# Altium schematic sheet visual_tactile.SchDoc
size A4; SheetNumber: 1; SheetTotal: 6
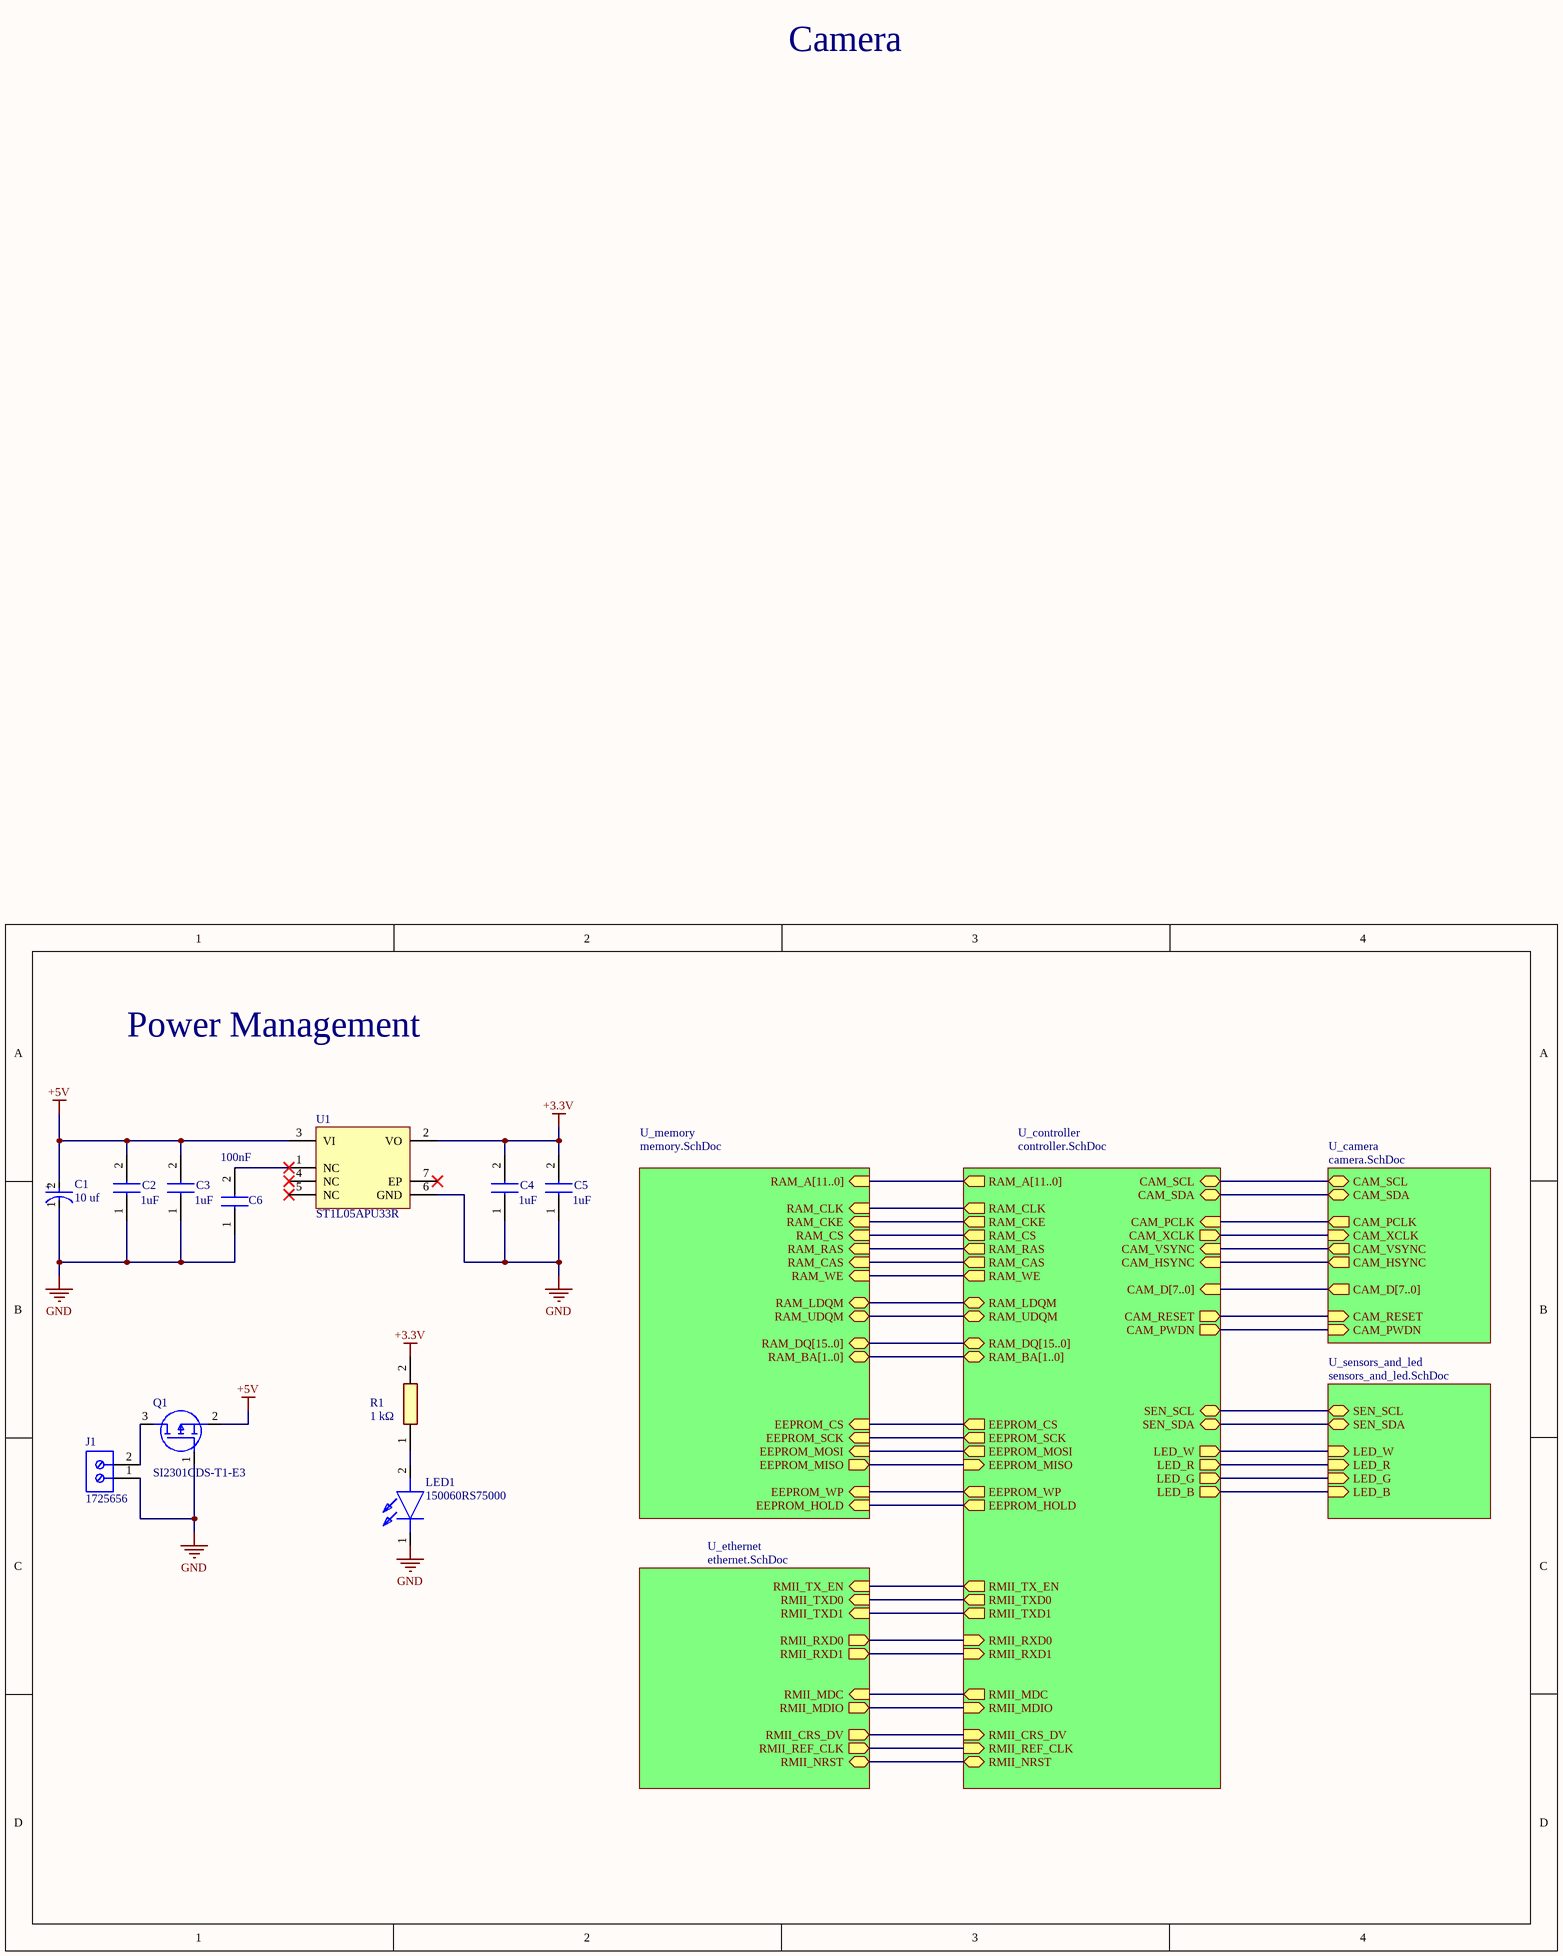
[diagram p0: visual_tactile.SchDoc]

## Parts
C1  10 uf  [FP-T491D-MFG]
C2  value 1uF  [CAPC1608X87N]
C3  value 1uF  [CAPC1608X87N]
C4  value 1uF  [CAPC1608X87N]
C5  value 1uF  [CAPC1608X87N]
C6  value 100nF  [CAPC1608X87N]  (hidden comment: CGA3E2X7R1H104K080AA)
J1  1725656  [PHOE-1725656-2]
LED1  150060RS75000  [LEDC1608X80N]
Q1  SI2301CDS-T1-E3  [SOT95P237X112-3N]
R1  1 kΩ  [RESC1005X35N]
U1  ST1L05APU33R  [DFN6D_M]

## Sub-sheets
U_camera = camera.SchDoc: CAM_SCL (bidir), CAM_SDA (bidir), CAM_RESET (in), CAM_PCLK (out), CAM_HSYNC (out), CAM_VSYNC (out), CAM_D[7..0] (out), CAM_XCLK (in), CAM_PWDN (in)
U_controller = controller.SchDoc: CAM_D[7..0] (in), CAM_PCLK (in), CAM_VSYNC (in), CAM_XCLK (out), CAM_HSYNC (in), CAM_SCL (bidir), CAM_SDA (bidir), CAM_RESET (out), CAM_PWDN (out), SEN_SCL (bidir), SEN_SDA (bidir), EEPROM_CS (out), EEPROM_SCK (out), EEPROM_MOSI (out), EEPROM_WP (out), EEPROM_HOLD (out), EEPROM_MISO (in), RAM_A[11..0] (out), RAM_DQ[15..0] (bidir), RAM_BA[1..0] (bidir), RAM_CLK (out), RAM_CKE (out), RAM_CS (out), RAM_RAS (out), RAM_CAS (out), RAM_WE (out), RAM_LDQM (bidir), RAM_UDQM (bidir), RMII_TX_EN (out), RMII_TXD0 (out), RMII_TXD1 (out), RMII_RXD0 (in), RMII_RXD1 (in), RMII_CRS_DV (in), RMII_MDC (out), RMII_MDIO (in), RMII_NRST (bidir), RMII_REF_CLK (in), LED_W (out), LED_R (out), LED_G (out), LED_B (out)
U_ethernet = ethernet.SchDoc: RMII_TX_EN (in), RMII_TXD0 (in), RMII_TXD1 (in), RMII_RXD0 (out), RMII_RXD1 (out), RMII_CRS_DV (out), RMII_MDC (in), RMII_MDIO (out), RMII_NRST (bidir), RMII_REF_CLK (out)
U_memory = memory.SchDoc: EEPROM_CS (in), EEPROM_SCK (in), EEPROM_MOSI (in), EEPROM_WP (in), EEPROM_HOLD (in), EEPROM_MISO (out), RAM_A[11..0] (in), RAM_DQ[15..0] (bidir), RAM_BA[1..0] (bidir), RAM_CLK (in), RAM_CKE (in), RAM_CS (in), RAM_RAS (in), RAM_CAS (in), RAM_WE (in), RAM_LDQM (bidir), RAM_UDQM (bidir)
U_sensors_and_led = sensors_and_led.SchDoc: SEN_SCL (bidir), SEN_SDA (bidir), LED_W (in), LED_R (in), LED_G (in), LED_B (in)

## Nets
+3.3V: C4.2 C5.2 R1.2 U1.2(VO)
+5V: C1.2(A) C2.2 C3.2 Q1.2(S) U1.3(VI)
GND: C1.1(C) C2.1 C3.1 C4.1 C5.1 C6.1 J1.1 LED1.1(K) Q1.1(G) U1.6(GND)
NetC6_2: C6.2 U1.1(NC)
NetJ1_2: J1.2 Q1.3(D)
NetLED1_2: LED1.2(A) R1.1
(unnamed): sheet U_controller/CAM_PCLK, sheet U_camera/CAM_PCLK
(unnamed): sheet U_controller/CAM_VSYNC, sheet U_camera/CAM_VSYNC
(unnamed): sheet U_controller/CAM_XCLK, sheet U_camera/CAM_XCLK
(unnamed): sheet U_controller/CAM_HSYNC, sheet U_camera/CAM_HSYNC
(unnamed): sheet U_controller/CAM_SCL, sheet U_camera/CAM_SCL
(unnamed): sheet U_controller/CAM_SDA, sheet U_camera/CAM_SDA
(unnamed): sheet U_controller/CAM_RESET, sheet U_camera/CAM_RESET
(unnamed): sheet U_controller/CAM_PWDN, sheet U_camera/CAM_PWDN
(unnamed): sheet U_controller/SEN_SCL, sheet U_sensors_and_led/SEN_SCL
(unnamed): sheet U_controller/SEN_SDA, sheet U_sensors_and_led/SEN_SDA
(unnamed): sheet U_controller/EEPROM_CS, sheet U_memory/EEPROM_CS
(unnamed): sheet U_controller/EEPROM_SCK, sheet U_memory/EEPROM_SCK
(unnamed): sheet U_controller/EEPROM_MOSI, sheet U_memory/EEPROM_MOSI
(unnamed): sheet U_controller/EEPROM_WP, sheet U_memory/EEPROM_WP
(unnamed): sheet U_controller/EEPROM_HOLD, sheet U_memory/EEPROM_HOLD
(unnamed): sheet U_controller/EEPROM_MISO, sheet U_memory/EEPROM_MISO
(unnamed): sheet U_controller/RAM_CLK, sheet U_memory/RAM_CLK
(unnamed): sheet U_controller/RAM_CKE, sheet U_memory/RAM_CKE
(unnamed): sheet U_controller/RAM_CS, sheet U_memory/RAM_CS
(unnamed): sheet U_controller/RAM_RAS, sheet U_memory/RAM_RAS
(unnamed): sheet U_controller/RAM_CAS, sheet U_memory/RAM_CAS
(unnamed): sheet U_controller/RAM_WE, sheet U_memory/RAM_WE
(unnamed): sheet U_controller/RAM_LDQM, sheet U_memory/RAM_LDQM
(unnamed): sheet U_controller/RAM_UDQM, sheet U_memory/RAM_UDQM
(unnamed): sheet U_controller/RMII_TX_EN, sheet U_ethernet/RMII_TX_EN
(unnamed): sheet U_controller/RMII_TXD0, sheet U_ethernet/RMII_TXD0
(unnamed): sheet U_controller/RMII_TXD1, sheet U_ethernet/RMII_TXD1
(unnamed): sheet U_controller/RMII_RXD0, sheet U_ethernet/RMII_RXD0
(unnamed): sheet U_controller/RMII_RXD1, sheet U_ethernet/RMII_RXD1
(unnamed): sheet U_controller/RMII_CRS_DV, sheet U_ethernet/RMII_CRS_DV
(unnamed): sheet U_controller/RMII_MDC, sheet U_ethernet/RMII_MDC
(unnamed): sheet U_controller/RMII_MDIO, sheet U_ethernet/RMII_MDIO
(unnamed): sheet U_controller/RMII_NRST, sheet U_ethernet/RMII_NRST
(unnamed): sheet U_controller/RMII_REF_CLK, sheet U_ethernet/RMII_REF_CLK
(unnamed): sheet U_controller/LED_W, sheet U_sensors_and_led/LED_W
(unnamed): sheet U_controller/LED_R, sheet U_sensors_and_led/LED_R
(unnamed): sheet U_controller/LED_G, sheet U_sensors_and_led/LED_G
(unnamed): sheet U_controller/LED_B, sheet U_sensors_and_led/LED_B

Not connected (* = marked no-connect by the designer): U1 4(NC)* 5(NC)* 7(EP)*

## Buses and harness runs
bus sheet U_camera/CAM_D[7..0] = sheet U_controller/CAM_D[7..0]
bus sheet U_controller/RAM_A[11..0] = sheet U_memory/RAM_A[11..0]
bus sheet U_controller/RAM_BA[1..0] = sheet U_memory/RAM_BA[1..0]
bus sheet U_controller/RAM_DQ[15..0] = sheet U_memory/RAM_DQ[15..0]

## Notes on the sheet
- Camera
- Power Management
- (in symbol CMP-2000-07200-2) +

## Library data of the parts
C1 = CMP-2000-07200-2: CAP TANT 10UF 10% 25V 2917; Tolerance: 20%; Life (Hours): 2000Hour; Dielectric Material: Tantalum; Dissipation Factor: 6%; Leakage Current: 2.5uA; Ripple Current: 387mA; Polarity: Polar; ESR (Equivalent Series Resistance): 1R; Voltage: 25V; Capacitance: 10uF; Voltage Rating: 25V; Voltage Rating (DC): 25V; Depth: 4.3mm; Mount: Surface Mount; Length: 7.3mm; Termination: SMD/SMT; Radiation Hardening: No; Max Operating Temperature: 125°C; REACH SVHC: No SVHC; Height: 2.8mm; Package Quantity: 1; Packaging: Tape and Reel; Case Code (Imperial): 2917; Width: 4.3mm; Min Operating Temperature: -55°C; Features: General Purpose; Case Code (Metric): 7343; Height - Seated (Max): 0.122inch; Number of Pins: 2; Lead Free: Lead Free; Case/Package: 2917
C2-C5 = C0603C300J5GACTU: Ceramic Capacitor, Multilayer, Ceramic, 10V, 10% +Tol, 10% -Tol, X5R, 15% TC, 1uF, Surface Mount, 0603; Manufacturer_Name: KEMET; Multilayer: Yes; Tolerance  (fill in as +-): 5%; Rated DC Voltage (URdc): 50V; Temperature Characteristics Code: C0G; Datasheet Link: https://content.kemet.com/datasheets/KEM_C1003_C0G_SMD.pdf; Height: 0.87mm; Manufacturer_Part_Number: C0603C300J5GACTU; Mouser Part Number: 80-C0603C300J5G; Mouser Price/Stock: https://www.mouser.co.uk/ProductDetail/KEMET/C0603C300J5GACTU?qs=KQYYlyH3z3RpeXhtJmCcMA%3D%3D; Arrow Part Number: C0603C300J5GACTU; Arrow Price/Stock: https://www.arrow.com/en/products/c0603c300j5gactu/kemet-corporation; Supplier: Mouser; Supplier Part Number: 80-C0603C300J5G; Manufacturer: KEMET; Manufacturer Part Number: C0603C300J5GACTU; RoHS: Yes; Category: Ceramic Capacitors; Stock: 135157; Pricing: 1=0.1, 10=0.032, 50=0.032, 100=0.016, 1000=0.011, 10000=0.008 (USD); Mounting Technology: Surface Mount; Pins: 2; Dielectric Material: Ceramic; Package Shape: Rectangular; Case/Package: 0603; Terminal Finish: Nickel; Min Operating Temperature: -55°C; Max Operating Temperature: 125°C; JESD-609 Code: e3; Capacitor Type: Ceramic; Package Style: SMTMeter; Packaging: Tape and Reel; Tolerance (fill in as +-): 5%; Termination: Wraparound; Length: 1.6mm; Width: 0.8mm; Reach SVHC Compliant: Yes; RoHS Compliant: Yes; ComponentLink1URL: https://datasheet.ciiva.com:443/pdfs/VipMasterIC/IC/KEME/KEME-S-A0005605168/KEME-S-A0005605168-1.pdf?src-supplier=IHS+Markit; ComponentLink1Description: https://datasheet.ciiva.com:443/pdfs/VipMasterIC/IC/KEME/KEME-S-A0005605168/KEME-S-A0005605168-1.pdf?src-supplier=IHS+Markit; ComponentLink2URL: https://datasheet.ciiva.com/22700/1691965-22700853.pdf?src-supplier=Element14; ComponentLink2Description: https://datasheet.ciiva.com/22700/1691965-22700853.pdf?src-supplier=Element14; ComponentLink3URL: https://datasheet.ciiva.com/5420/kem-c1003-c0g-smd-356956-5420875.pdf?src-supplier=Mouser; ComponentLink3Description: https://datasheet.ciiva.com/5420/kem-c1003-c0g-smd-356956-5420875.pdf?src-supplier=Mouser; ComponentLink4URL: https://datasheet.ciiva.com:443/pdfs/VipMasterIC/IC/TDKC/TDKC-S-A0008796792/TDKC-S-A0008796792-1.pdf?src-supplier=IHS+Markit; ComponentLink4Description: https://datasheet.ciiva.com:443/pdfs/VipMasterIC/IC/TDKC/TDKC-S-A0008796792/TDKC-S-A0008796792-1.pdf?src-supplier=IHS+Markit; ComponentLink5URL: https://datasheet.ciiva.com:443/pdfs/VipMasterIC/IC/KEME/KEME-S-A0008991665/KEME-S-A0008991665-1.pdf?src-supplier=IHS+Markit; ComponentLink5Description: https://datasheet.ciiva.com:443/pdfs/VipMasterIC/IC/KEME/KEME-S-A0008991665/KEME-S-A0008991665-1.pdf?src-supplier=IHS+Markit
C6 = C0603C300J5GACTU: Ceramic Capacitor, Multilayer, Ceramic, 50V, 10% +Tol, 10% -Tol, X7R, 15% TC, 0.1uF, Surface Mount, 0603; Manufacturer_Name: KEMET; Manufacturer: TDK; Multilayer: Yes; Reference Standard: AEC-Q200; Datasheet Link: https://content.kemet.com/datasheets/KEM_C1003_C0G_SMD.pdf; Height: 0.87mm; Manufacturer_Part_Number: C0603C300J5GACTU; Mouser Part Number: 80-C0603C300J5G; Mouser Price/Stock: https://www.mouser.co.uk/ProductDetail/KEMET/C0603C300J5GACTU?qs=KQYYlyH3z3RpeXhtJmCcMA%3D%3D; Arrow Part Number: C0603C300J5GACTU; Arrow Price/Stock: https://www.arrow.com/en/products/c0603c300j5gactu/kemet-corporation; Supplier: Rs; Supplier Part Number: 7882985P; Manufacturer Part Number: CGA3E2X7R1H104K080AA; RoHS: Yes; Category: Ceramic Capacitors; Stock: 84850; Pricing: 250=0.042, 500=0.039, 1000=0.037, 2500=0.033 (EUR); Mounting Technology: Surface Mount; Pins: 2; Dielectric Material: Ceramic; Package Shape: Rectangular; Case/Package: 0603; Terminal Finish: Nickel; Min Operating Temperature: -55°C; Max Operating Temperature: 125°C; JESD-609 Code: e3; Capacitor Type: Ceramic; Tolerance  (fill in as +-): 10%; Package Style: SMTMeter; Packaging: Tape and Reel; Tolerance (fill in as +-): 10%; Rated DC Voltage (URdc): 50V; Temperature Characteristics Code: X7R; Termination: Wraparound; Length: 1.6mm; Width: 0.8mm; Reach SVHC Compliant: Yes; RoHS Compliant: Yes; ComponentLink1URL: https://datasheet.ciiva.com:443/pdfs/VipMasterIC/IC/TDKC/TDKC-S-A0008953915/TDKC-S-A0008953915-1.pdf?src-supplier=IHS+Markit; ComponentLink1Description: https://datasheet.ciiva.com:443/pdfs/VipMasterIC/IC/TDKC/TDKC-S-A0008953915/TDKC-S-A0008953915-1.pdf?src-supplier=IHS+Markit
J1 = CMP-2000-05299-1: Male Header, Pitch 2.54 mm, 1 x 2 Position, Height 9 mm, Tail Length 3.5 mm; Manufacturer: Phoenix Contact; Number of contacts: 2; Content: 250pc(s); Pitch: 2.54mm; Industrial packaging: Yes; Colour: Green; Manufacturer part No.: 1725656; Type: MPT0,5/2-2,54; Datasheet URL: http://datasheet.octopart.com/1725656-Phoenix-Contact-datasheet-5302866.pdf; Manufacturer URL: http://www.phoenixcontact.com/; Datasheet Version: Apr-08
LED1 = 150060RS75000: LED; Manufacturer_Name: Wurth Elektronik; Datasheet Link: http://katalog.we-online.de/led/datasheet/150060RS75000.pdf; Height: 0.8mm; Manufacturer_Part_Number: 150060RS75000; Mouser Part Number: 710-150060RS75000; Mouser Price/Stock: https://www.mouser.co.uk/ProductDetail/Wurth-Elektronik/150060RS75000?qs=LlUlMxKIyB3QnmZ3fw%2FVCA%3D%3D
Q1 = SI2301CDS-T1-E3: MOSFET (P-Channel); Manufacturer_Name: Vishay; Datasheet Link: https://componentsearchengine.com/Datasheets/2/SI2301CDS-T1-E3.pdf; Height: 1.12mm; Manufacturer_Part_Number: SI2301CDS-T1-E3; Mouser Part Number: 781-SI2301CDS-E3; Mouser Price/Stock: https://www.mouser.co.uk/ProductDetail/Vishay-Semiconductors/SI2301CDS-T1-E3?qs=45wPT2wjtGkQH%252ByrbRpz4Q%3D%3D; Arrow Part Number: SI2301CDS-T1-E3; Arrow Price/Stock: https://www.arrow.com/en/products/si2301cds-t1-e3/vishay?region=nac
R1 = CPF0402B100KE: Resistor; Manufacturer_Name: TE Connectivity; Datasheet Link: http://www.farnell.com/datasheets/1786775.pdf; Height: 0.35mm; Manufacturer_Part_Number: CPF0402B100KE; Mouser Part Number: 279-CPF0402B100KE; Mouser Price/Stock: https://www.mouser.co.uk/ProductDetail/TE-Connectivity-Holsworthy/CPF0402B100KE?qs=CXI0wBT1M2h4W2Gm72yIGA%3D%3D; Arrow Part Number: CPF0402B100KE; Arrow Price/Stock: https://www.arrow.com/en/products/cpf0402b100ke/te-connectivity?region=nac
U1 = CMP-0244-00290-1: Very Low Quiescent BiCMOS Voltage Regulator, 3.3V, 6-Pin VFDFPN, Tape and Reel; ComponentLink2Description: Datasheet; PackageDescription: 6-Pin Plastic, Dual LLP, 3 x 3 mm Body, 0.95 mm Pitch, Exposed Pad; DatasheetVersion: 1/09/2009; ComponentLink1URL: http://www.st.com; ComponentLink1Description: Manufacturer URL; PackageVersion: 2008; ComponentLink2URL: http://www.st.com/internet/com/TECHNICAL_RESOURCES/TECHNICAL_LITERATURE/DATASHEET/CD00186925.pdf; PackageReference: DFN6D